# Altium schematic sheet SensorTemperatura.SchDoc
size A4
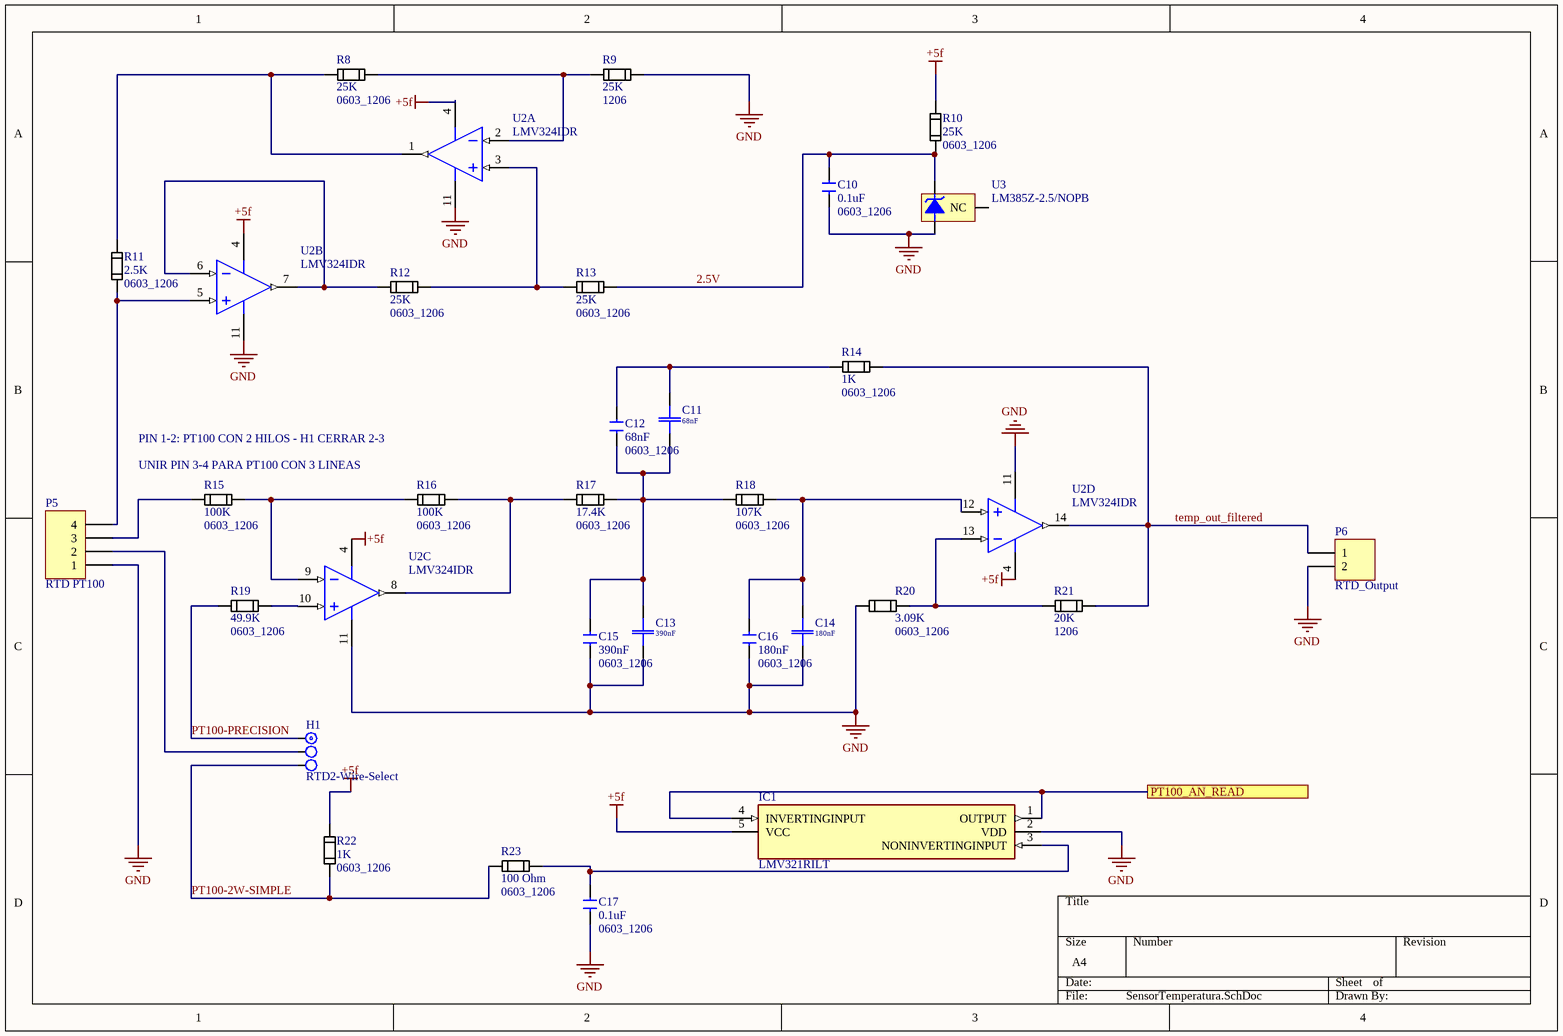
[diagram p0: SensorTemperatura.SchDoc]

## Parts
C10  0.1uF  value 0603_1206  [SMD_CHIP_CAP_CER_0603_TO_1206]
C11  68nF  [Cap-Disk-D5.5-R5.08]
C12  68nF  value 0603_1206  [SMD_CHIP_CAP_CER_0603_TO_1206]
C13  390nF  [Cap-Disk-D5.5-R5.08]
C14  180nF  [Cap-Disk-D5.5-R5.08]
C15  390nF  value 0603_1206  [SMD_CHIP_CAP_CER_0603_TO_1206]
C16  180nF  value 0603_1206  [SMD_CHIP_CAP_CER_0603_TO_1206]
C17  0.1uF  value 0603_1206  [SMD_CHIP_CAP_CER_0603_TO_1206]
H1  RTD2-Wire-Select  [J1x3]
IC1  LMV321RILT  [SOT95P280X145-5N]
P5  RTD PT100  [KF2EDGV/R-4P]
P6  RTD_Output  [HDR1X2]
R8  25K  value 0603_1206  [SMD_CHIP_RESISTOR_1206]
R9  25K  value 1206  [SMD_CHIP_RESISTOR_1206]
R10  25K  value 0603_1206  [SMD_CHIP_RESISTOR_0603_TO_1206]
R11  2.5K  value 0603_1206  [SMD_CHIP_RESISTOR_1206]
R12  25K  value 0603_1206  [SMD_CHIP_RESISTOR_1206]
R13  25K  value 0603_1206  [SMD_CHIP_RESISTOR_1206]
R14  1K  value 0603_1206  [SMD_CHIP_RESISTOR_0603_TO_1206]
R15  100K  value 0603_1206  [SMD_CHIP_RESISTOR_1206]
R16  100K  value 0603_1206  [SMD_CHIP_RESISTOR_1206]
R17  17.4K  value 0603_1206  [SMD_CHIP_RESISTOR_1206]
R18  107K  value 0603_1206  [SMD_CHIP_RESISTOR_1206]
R19  49.9K  value 0603_1206  [SMD_CHIP_RESISTOR_1206]
R20  3.09K  value 0603_1206  [SMD_CHIP_RESISTOR_1206]
R21  20K  value 1206  [SMD_CHIP_RESISTOR_1206]
R22  1K  value 0603_1206  [SMD_CHIP_RESISTOR_1206]
R23  100 Ohm  value 0603_1206  [SMD_CHIP_RESISTOR_1206]
U2  LMV324IDR  [D0014A_V]  (parts A,B,C,D of 4)
U3  LM385Z-2.5/NOPB  [Z03A]

## Ports
PT100_AN_READ

## Nets
+5f: IC1.5(VCC) R10.2 R22.2 U2.4(VCC+)
GND: C10.1 C13.2 C14.2 C15.1 C16.1 C17.1 IC1.2(VDD) P5.1 P6.2 R9.2 R20.1 U2.11(GND) U3.3(-V)
2.5V: C10.2 R10.1 R13.2 U3.2(+V)
PT100-2W-SIMPLE: H1.3 R22.1 R23.2
PT100-PRECISION: H1.1 R19.1
PT100_AN_READ: IC1.1(OUTPUT) IC1.4(INVERTINGINPUT) ; port PT100_AN_READ
temp_out_filtered: P6.1 R14.2 R21.2 U2.14(4OUT)
NetC11_1: C11.1 C12.2 R14.1
NetC11_2: C11.2 C12.1 C13.1 C15.2 R17.2 R18.1
NetC14_1: C14.1 C16.2 R18.2 U2.12(4IN+)
NetC17_2: C17.2 IC1.3(NONINVERTINGINPUT) R23.1
NetH1_2: H1.2 P5.2
NetP5_3: P5.3 R15.1
NetP5_4: P5.4 R11.1 U2.5(2IN+)
NetR8_1: R8.1 R11.2 U2.1(1OUT)
NetR8_2: R8.2 R9.1 U2.2(1IN-)
NetR12_1: R12.1 U2.6(2IN-) U2.7(2OUT)
NetR12_2: R12.2 R13.1 U2.3(1IN+)
NetR15_2: R15.2 R16.1 U2.9(3IN-)
NetR16_2: R16.2 R17.1 U2.8(3OUT)
NetR19_2: R19.2 U2.10(3IN+)
NetR20_2: R20.2 R21.1 U2.13(4IN-)

Not connected (* = marked no-connect by the designer): U3 1(NC)

## Notes on the sheet
- PIN 1-2: PT100 CON 2 HILOS - H1 CERRAR 2-3
- (near R15) UNIR PIN 3-4 PARA PT100 CON 3 LINEAS

## Library data of the parts
C10 C12 C15-C17 = SMD_CHIP_CAP_CER_0603_TO_1206
C11 C13 C14 = Cer Disc HV 820p 1kV: 820p 1kV Y5P; Tip: Suntan 820pF 1kV Y5P; Price: 0.072
  C11: Value: 68nF
  C13: Value: 390nF
  C14: Value: 180nF
H1 = H-1x3: Price: 0.03
IC1 = LMV321RILT: Integrated Circuit; Manufacturer_Name: STMicroelectronics; Allied_Number: 70390334; Datasheet Link: http://www.st.com/st-web-ui/static/active/en/resource/technical/document/datasheet/CD00079372.pdf; Height: 1.45mm; Manufacturer_Part_Number: LMV321RILT; Mouser Part Number: 511-LMV321RILT; Mouser Price/Stock: https://www.mouser.com/Search/Refine.aspx?Keyword=511-LMV321RILT; RS Part Number: 0426130P; RS Price/Stock: http://uk.rs-online.com/web/p/products/0426130P; Allied Price/Stock: http://www.alliedelec.com/stmicroelectronics-lmv321rilt/70390334/
P5 = Header 4: Header, 4-Pin; LatestRevisionDate: 17-Jul-2002; LatestRevisionNote: Re-released for DXP Platform.; Publisher: Altium Limited
P6 = Header 2: Header, 2-Pin; LatestRevisionDate: 17-Jul-2002; LatestRevisionNote: Re-released for DXP Platform.; Publisher: Altium Limited
R8 R10-R20 R22 R23 = SMD_CHIP_RESISTOR_0603_TO_1206
R9 R21 = SMD_CHIP_RESISTOR_1206
U2 = CMP-1685-00010-1: Quad Low-Voltage Rail-to-Rail Output Operational Amplifier, 2.7 to 5.5 V, -40 to 125 degC, 14-Pin SOIC (D), Green (RoHS & no Sb/Br), Tape and Reel; ComponentLink3Description: Package Specification; ComponentLink2URL: http://www.ti.com/lit/ds/symlink/lmv324.pdf; ComponentLink3URL: http://www.ti.com/lit/ml/mpds177g/mpds177g.pdf; DatasheetVersion: SLOS263W, 10/2014; ComponentLink1URL: http://www.ti.com/; Code_JEDEC: MS-012; ComponentLink1Description: Manufacturer URL; PackageDescription: 14-Pin Small Outline Integrated Circuit, Body 8.65 x 3.9 mm, Pitch 1.27 mm; PackageReference: D0014A; ComponentLink2Description: Datasheet
U3 = CMP-0074-00017-2: Micropower Voltage Reference Diode, 3-pin TO-92, Pb-Free; Manufacturer: National Semiconductor; CompType: Voltage Reference IC; PowerWise: N; PackageTopMarking: NSXYTT*LM385*Z2.5; DatasheetVersion: Jan-2008; PackageReference: Z03A; PackageDescription: TO-92, Molded, 3 Lead; PackageVersion: revG, Sep-2000; Code_JEDEC: TO-226-AA; ComponentLink3Description: Z03A Package Page; ComponentLink3URL: http://www.national.com/packaging/folders/z03a.html; RoHS: Y; ComponentLink1URL: http://www.national.com/ds/LM/LM385-2.5.pdf; ComponentLink2Description: LM385-2.5 Web Page; ComponentLink2URL: http://www.national.com/pf/LM/LM385-2.5.html; ComponentLink1Description: LM385-2.5 Datasheet; RevisionNote: Component URLs added; PinCount: 3